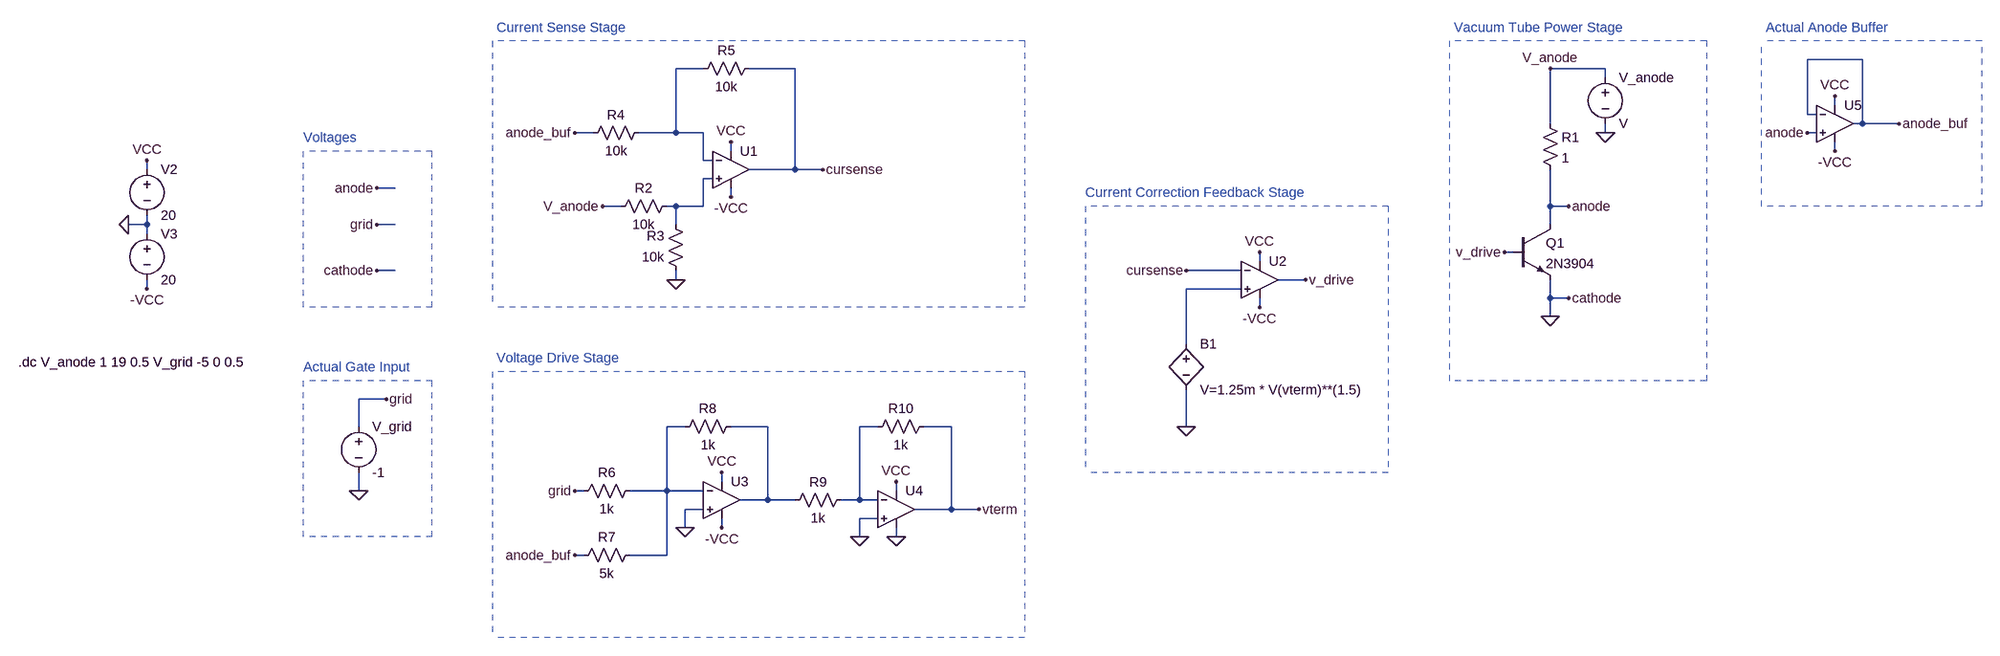
[diagram p0: schematic tube_first_iteration.asc]
tube_first_iteration.asc, the LTspice schematic file:
Version 4
SHEET 1 4020 852
WIRE 3184 -400 3088 -400
WIRE 1136 -384 1088 -384
WIRE 1296 -384 1216 -384
WIRE 2736 -384 2640 -384
WIRE 2736 -368 2736 -384
WIRE 3136 -320 3136 -336
WIRE 3088 -304 3088 -400
WIRE 3104 -304 3088 -304
WIRE 2640 -288 2640 -384
WIRE 3184 -288 3184 -400
WIRE 3184 -288 3168 -288
WIRE 3248 -288 3184 -288
WIRE 944 -272 912 -272
WIRE 1088 -272 1088 -384
WIRE 1088 -272 1024 -272
WIRE 1136 -272 1088 -272
WIRE 2736 -272 2736 -288
WIRE 3104 -272 3088 -272
WIRE 1184 -240 1184 -256
WIRE 3136 -240 3136 -256
WIRE 1136 -224 1136 -272
WIRE 1152 -224 1136 -224
WIRE -352 -208 -352 -224
WIRE 1296 -208 1296 -384
WIRE 1296 -208 1216 -208
WIRE 1344 -208 1296 -208
WIRE 1152 -192 1136 -192
WIRE 416 -176 384 -176
WIRE 1184 -160 1184 -176
WIRE 992 -144 960 -144
WIRE 1088 -144 1072 -144
WIRE 1136 -144 1136 -192
WIRE 1136 -144 1088 -144
WIRE 2640 -144 2640 -208
WIRE 2672 -144 2640 -144
WIRE -352 -112 -352 -128
WIRE -352 -112 -384 -112
WIRE 416 -112 384 -112
WIRE 1088 -112 1088 -144
WIRE 2640 -112 2640 -144
WIRE -352 -96 -352 -112
WIRE 2576 -64 2560 -64
WIRE 2112 -48 2112 -64
WIRE 416 -32 384 -32
WIRE 2080 -32 1984 -32
WIRE 1088 -16 1088 -32
WIRE 2192 -16 2144 -16
WIRE -352 0 -352 -16
WIRE 2080 0 1984 0
WIRE 2640 16 2640 -16
WIRE 2672 16 2640 16
WIRE 2112 32 2112 16
WIRE 2640 48 2640 16
WIRE 1984 96 1984 0
WIRE 400 192 352 192
WIRE 352 240 352 192
WIRE 1104 240 1072 240
WIRE 1248 240 1184 240
WIRE 1440 240 1408 240
WIRE 1568 240 1520 240
WIRE 1984 240 1984 176
WIRE 1168 336 1168 320
WIRE 352 352 352 320
WIRE 928 352 912 352
WIRE 1072 352 1072 240
WIRE 1072 352 1008 352
WIRE 1136 352 1072 352
WIRE 1472 352 1472 336
WIRE 1248 368 1248 240
WIRE 1248 368 1200 368
WIRE 1296 368 1248 368
WIRE 1408 368 1408 240
WIRE 1408 368 1376 368
WIRE 1440 368 1408 368
WIRE 1136 384 1104 384
WIRE 1568 384 1568 240
WIRE 1568 384 1504 384
WIRE 1616 384 1568 384
WIRE 1440 400 1408 400
WIRE 1104 416 1104 384
WIRE 1168 416 1168 400
WIRE 1408 432 1408 400
WIRE 1472 432 1472 416
WIRE 928 464 912 464
WIRE 1072 464 1072 352
WIRE 1072 464 1008 464
FLAG 1984 240 0
FLAG -384 -112 0
FLAG -352 -224 VCC
FLAG -352 0 -VCC
FLAG 2640 48 0
FLAG 3248 -288 anode_buf
FLAG 1088 -16 0
FLAG 1184 -256 VCC
FLAG 1184 -160 -VCC
FLAG 912 -272 anode_buf
FLAG 1344 -208 cursense
FLAG 1984 -32 cursense
FLAG 2112 -64 VCC
FLAG 2112 32 -VCC
FLAG 400 192 grid
FLAG 352 352 0
FLAG 1104 416 0
FLAG 1168 320 VCC
FLAG 912 464 anode_buf
FLAG 912 352 grid
FLAG 1408 432 0
FLAG 1472 336 VCC
FLAG 1616 384 vterm
FLAG 1168 416 -VCC
FLAG 1472 432 0
FLAG 3136 -336 VCC
FLAG 3136 -240 -VCC
FLAG 2736 -272 0
FLAG 2640 -384 V_anode
FLAG 960 -144 V_anode
FLAG 2672 -144 anode
FLAG 3088 -272 anode
FLAG 2672 16 cathode
FLAG 2192 -16 v_drive
FLAG 2560 -64 v_drive
FLAG 384 -112 grid
FLAG 384 -176 anode
FLAG 384 -32 cathode
SYMBOL bv 1984 80 R0
SYMATTR InstName B1
SYMATTR Value V=1.25m * V(vterm)**(1.5)
SYMBOL npn 2576 -112 R0
SYMATTR InstName Q1
SYMATTR Value 2N3904
SYMBOL voltage -352 -224 R0
WINDOW 123 0 0 Left 0
WINDOW 39 0 0 Left 0
SYMATTR InstName V2
SYMATTR Value 20
SYMBOL voltage -352 -112 R0
WINDOW 123 0 0 Left 0
WINDOW 39 0 0 Left 0
SYMATTR InstName V3
SYMATTR Value 20
SYMBOL OpAmps\\UniversalOpAmp2 1184 -208 R0
SYMATTR InstName U1
SYMBOL res 1088 -160 R90
WINDOW 0 0 56 VBottom 2
WINDOW 3 32 56 VTop 2
SYMATTR InstName R2
SYMATTR Value 10k
SYMBOL res 1104 -16 R180
WINDOW 0 36 76 Left 2
WINDOW 3 36 40 Left 2
SYMATTR InstName R3
SYMATTR Value 10k
SYMBOL res 1040 -288 R90
WINDOW 0 0 56 VBottom 2
WINDOW 3 32 56 VTop 2
SYMATTR InstName R4
SYMATTR Value 10k
SYMBOL res 1232 -400 R90
WINDOW 0 0 56 VBottom 2
WINDOW 3 32 56 VTop 2
SYMATTR InstName R5
SYMATTR Value 10k
SYMBOL OpAmps\\UniversalOpAmp2 2112 -16 R0
SYMATTR InstName U2
SYMBOL voltage 352 224 R0
WINDOW 123 0 0 Left 0
WINDOW 39 0 0 Left 0
SYMATTR InstName V_grid
SYMATTR Value -1
SYMBOL OpAmps\\UniversalOpAmp2 1168 368 R0
SYMATTR InstName U3
SYMBOL res 1024 336 R90
WINDOW 0 0 56 VBottom 2
WINDOW 3 32 56 VTop 2
SYMATTR InstName R6
SYMATTR Value 1k
SYMBOL res 1024 448 R90
WINDOW 0 0 56 VBottom 2
WINDOW 3 32 56 VTop 2
SYMATTR InstName R7
SYMATTR Value 5k
SYMBOL res 1200 224 R90
WINDOW 0 0 56 VBottom 2
WINDOW 3 32 56 VTop 2
SYMATTR InstName R8
SYMATTR Value 1k
SYMBOL res 1392 352 R90
WINDOW 0 0 56 VBottom 2
WINDOW 3 32 56 VTop 2
SYMATTR InstName R9
SYMATTR Value 1k
SYMBOL OpAmps\\UniversalOpAmp2 1472 384 R0
SYMATTR InstName U4
SYMBOL res 1536 224 R90
WINDOW 0 0 56 VBottom 2
WINDOW 3 32 56 VTop 2
SYMATTR InstName R10
SYMATTR Value 1k
SYMBOL OpAmps\\UniversalOpAmp2 3136 -288 R0
SYMATTR InstName U5
SYMBOL voltage 2736 -384 R0
SYMATTR InstName V_anode
SYMBOL res 2624 -304 R0
SYMATTR InstName R1
SYMATTR Value 1
TEXT -576 128 Left 2 !.dc V_anode 1 19 0.5 V_grid -5 0 0.5
TEXT 2472 -456 Left 2 ;Vacuum Tube Power Stage
TEXT 3016 -456 Left 2 ;Actual Anode Buffer
TEXT 256 136 Left 2 ;Actual Gate Input
TEXT 776 -456 Left 2 ;Current Sense Stage
TEXT 776 120 Left 2 ;Voltage Drive Stage
TEXT 1808 -168 Left 2 ;Current Correction Feedback Stage
TEXT 256 -264 Left 2 ;Voltages
LINE Normal 2912 -432 2464 -432 2
LINE Normal 2464 -432 2464 160 2
LINE Normal 2912 160 2464 160 2
LINE Normal 2912 -432 2912 160 2
LINE Normal 3392 -432 3008 -432 2
LINE Normal 3392 -144 3008 -144 2
LINE Normal 3392 -144 3392 -432 2
LINE Normal 3008 -144 3008 -432 2
LINE Normal 480 160 256 160 2
LINE Normal 480 432 256 432 2
LINE Normal 480 432 480 160 2
LINE Normal 256 432 256 160 2
LINE Normal 768 -432 768 32 2
LINE Normal 1696 -432 1696 32 2
LINE Normal 1696 -432 768 -432 2
LINE Normal 1696 32 768 32 2
LINE Normal 1808 -144 1808 320 2
LINE Normal 2336 -144 2336 320 2
LINE Normal 2336 -144 1808 -144 2
LINE Normal 2336 320 1808 320 2
LINE Normal 768 144 768 608 2
LINE Normal 1696 144 1696 608 2
LINE Normal 1696 144 768 144 2
LINE Normal 1696 608 768 608 2
LINE Normal 480 -240 256 -240 2
LINE Normal 480 32 256 32 2
LINE Normal 480 32 480 -240 2
LINE Normal 256 32 256 -240 2

The netlist it stands for:
* tube_first_iteration.asc
B1 N003 0 V=1.25m * V(vterm)**(1.5)
Q1 anode v_drive 0 0 2N3904
V2 VCC 0 20
V3 0 -VCC 20
XU1 N002 N001 VCC -VCC cursense level2 Avol=1Meg GBW=10Meg Slew=10Meg Ilimit=25m Rail=0 Vos=0 En=0 Enk=0 In=0 Ink=0 Rin=500Meg  ; pins In+ In- V+ V- OUT
R2 N002 V_anode 10k
R3 0 N002 10k
R4 N001 anode_buf 10k
R5 cursense N001 10k
XU2 N003 cursense VCC -VCC v_drive level2 Avol=1Meg GBW=10Meg Slew=10Meg Ilimit=25m Rail=0 Vos=0 En=0 Enk=0 In=0 Ink=0 Rin=500Meg  ; pins In+ In- V+ V- OUT
V_grid grid 0 -1
XU3 0 N004 VCC -VCC N005 level2 Avol=1Meg GBW=10Meg Slew=10Meg Ilimit=25m Rail=0 Vos=0 En=0 Enk=0 In=0 Ink=0 Rin=500Meg  ; pins In+ In- V+ V- OUT
R6 N004 grid 1k
R7 N004 anode_buf 5k
R8 N005 N004 1k
R9 N006 N005 1k
XU4 0 N006 VCC 0 vterm level2 Avol=1Meg GBW=10Meg Slew=10Meg Ilimit=25m Rail=0 Vos=0 En=0 Enk=0 In=0 Ink=0 Rin=500Meg  ; pins In+ In- V+ V- OUT
R10 vterm N006 1k
XU5 anode anode_buf VCC -VCC anode_buf level2 Avol=1Meg GBW=10Meg Slew=10Meg Ilimit=25m Rail=0 Vos=0 En=0 Enk=0 In=0 Ink=0 Rin=500Meg  ; pins In+ In- V+ V- OUT
V_anode V_anode 0 V
R1 V_anode anode 1
.model NPN NPN
.model PNP PNP
.lib standard.bjt
.dc V_anode 1 19 0.5 V_grid -5 0 0.5
* Vacuum Tube Power Stage
* Actual Anode Buffer
* Actual Gate Input
* Current Sense Stage
* Voltage Drive Stage
* Current Correction Feedback Stage
* Voltages
.lib UniversalOpAmp2.lib
.backanno
.end